# EAGLE design asam_mit_RFM (EAGLE 6.6.0)
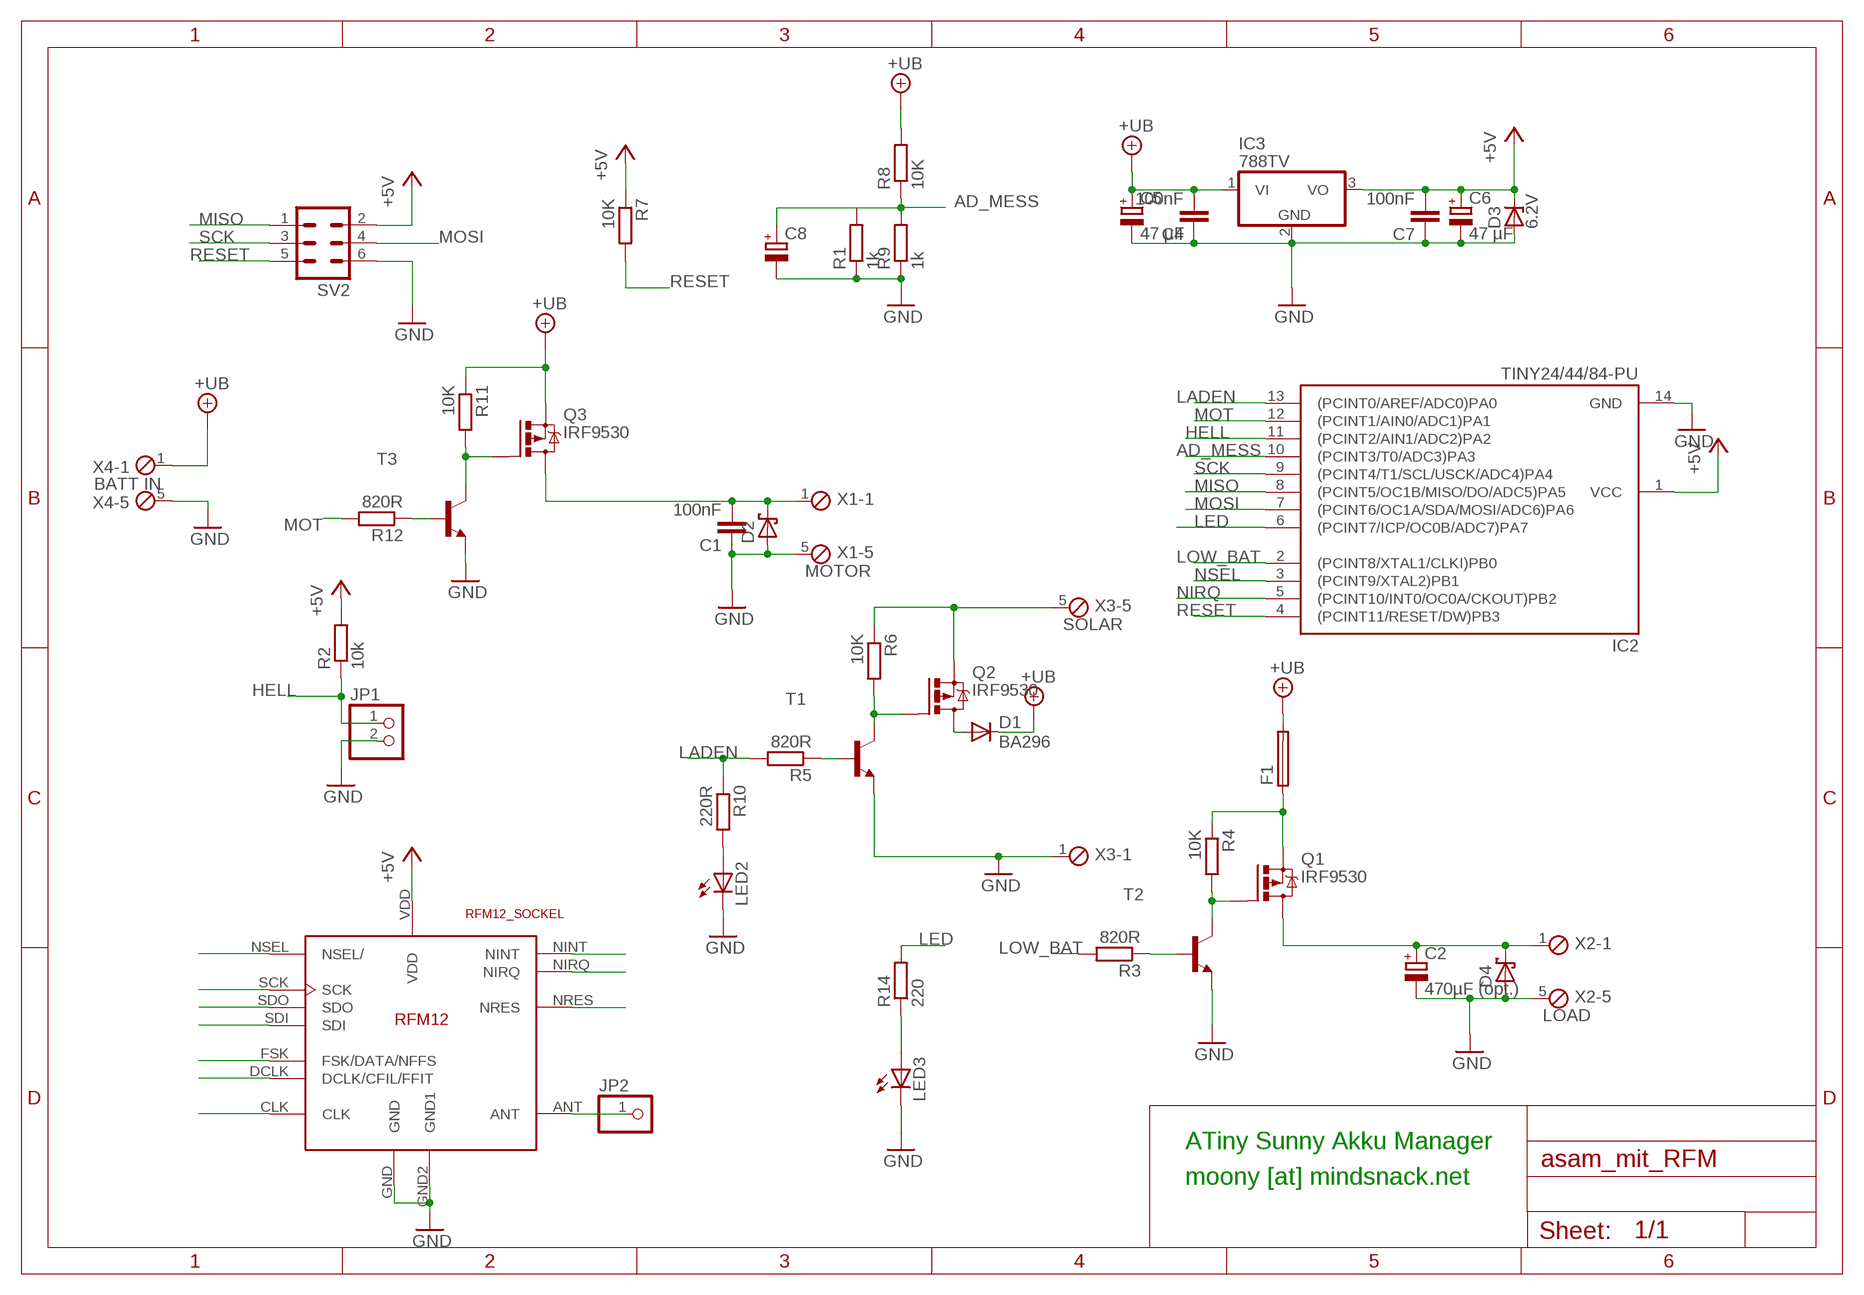
[diagram p0: schematic, sheet 1]

## Parts
C1  100nF  C-EU075-032X103  [C075-032X103]
C2  470µF (opt.)  CPOL-EUE5-10.5  [E5-10,5]
C4  100nF  C-EU075-032X103  [C075-032X103]
C5  47 µF  CPOL-EUE5-10.5  [E5-10,5]
C6  47 µF  CPOL-EUE5-10.5  [E5-10,5]
C7  100nF  C-EU075-032X103  [C075-032X103]
C8  CPOL-EUE5-10.5  [E5-10,5]
D1  BA296  [P2-15]
D2  SCHOTTKY-DIODEDO35-7  [DO35-7]
D3  6.2V  ZENER-DIODEC1702-15  [C1702-15]
D4  SCHOTTKY-DIODEDO35-7  [DO35-7]
F1  SH22,5  [SH22,5]
IC2  TINY24/44/84-PU  [DIL14]
IC3  788TV  [TO220V]
JP1  PINHD-1X2  [1X02]
JP2  PINHD-1X1  [1X01]
LED2  LED3MM  [LED3MM]
LED3  LED3MM  [LED3MM]
Q1  IRF9530  [TO220BV]
Q2  IRF9530  [TO220BV]
Q3  IRF9530  [TO220BV]
R1  1k  R-EU_0207/10  [0207/10]
R2  10k  R-EU_0207/10  [0207/10]
R3  820R  R-EU_0207/10  [0207/10]
R4  10K  R-EU_0207/12  [0207/12]
R5  820R  R-EU_0207/10  [0207/10]
R6  10K  R-EU_0207/12  [0207/12]
R7  10K  R-EU_0207/12  [0207/12]
R8  10K  R-EU_0207/10  [0207/10]
R9  1k  R-EU_0207/10  [0207/10]
R10  220R  R-EU_0207/10  [0207/10]
R11  10K  R-EU_0207/12  [0207/12]
R12  820R  R-EU_0207/10  [0207/10]
R14  220  R-EU_0207/10  [0207/10]
SV2  MA03-2  [MA03-2]
T1  BC546-NPN-TO92-CBE  [TO92-CBE]
T2  BC546-NPN-TO92-CBE  [TO92-CBE]
T3  BC546-NPN-TO92-CBE  [TO92-CBE]
U$1  RFM12_SOCKEL  [RFM12_SOCKEL]
X1  MOTOR  MPT5  [5POL254]
X2  LOAD  MPT5  [5POL254]
X3  SOLAR  MPT5  [5POL254]
X4  BATT IN  MPT5  [5POL254]

## Nets
+5V: C6.+ C7.2 D3.C IC2.1(VCC) IC3.3(VO) R2.2 R7.1 SV2.2 U$1.VDD
+UB: C4.2 C5.+ D1.C F1.2 IC3.1(VI) Q3.S R8.2 R11.1 X4.1
AD_MESS: C8.+ IC2.10((PCINT3/T0/ADC3)PA3) R1.2 R8.1 R9.2
GND: C1.1 C2.- C4.1 C5.- C6.- C7.1 C8.- D2.A D3.A D4.A IC2.14(GND) IC3.2(GND) JP1.2 LED2.K(C) LED3.K(C) R1.1 R9.1 SV2.6 T1.E T2.E T3.E U$1.GND U$1.GND2(GND1) X1.5 X2.5 X3.1 X4.5
HELL: IC2.11((PCINT2/AIN1/ADC2)PA2) JP1.1 R2.1
LADEN: IC2.13((PCINT0/AREF/ADC0)PA0) R5.2 R10.1
LED: IC2.6((PCINT7/ICP/OC0B/ADC7)PA7) R14.2
LOW_BAT: IC2.2((PCINT8/XTAL1/CLKI)PB0) R3.2
MISO: IC2.8((PCINT5/OC1B/MISO/DO/ADC5)PA5) SV2.1 U$1.SDI
MOSI: IC2.7((PCINT6/OC1A/SDA/MOSI/ADC6)PA6) SV2.4 U$1.SDO
MOT: IC2.12((PCINT1/AIN0/ADC1)PA1) R12.2
N$1: C1.2 D2.C Q3.D X1.1
N$2: R3.1 T2.B
N$3: Q1.G R4.2 T2.C
N$4: Q2.S R6.1 X3.5
N$5: Q2.G R6.2 T1.C
N$6: Q3.G R11.2 T3.C
N$7: R5.1 T1.B
N$8: LED2.A R10.2
N$9: D1.A Q2.D
N$10: R12.1 T3.B
N$11: F1.1 Q1.S R4.1
N$13: LED3.A R14.1
N$16: U$1.FSK(FSK/DATA/NFFS)
N$17: U$1.DCLK(DCLK/CFIL/FFIT)
N$18: C2.+ D4.C Q1.D X2.1
N$19: U$1.CLK
N$22: JP2.1 U$1.ANT
N$23: U$1.NRES
N$25: U$1.NINT
NIRQ: IC2.5((PCINT10/INT0/OC0A/CKOUT)PB2) U$1.NIRQ
NSEL: IC2.3((PCINT9/XTAL2)PB1) U$1.NSEL(NSEL/)
RESET: IC2.4((PCINT11/RESET/DW)PB3) R7.2 SV2.5
SCK: IC2.9((PCINT4/T1/SCL/USCK/ADC4)PA4) SV2.3 U$1.SCK
Unconnected: X1.2 X1.3 X1.4 X2.2 X2.3 X2.4 X3.2 X3.3 X3.4 X4.2 X4.3 X4.4

## Notes on the sheet
- ATiny Sunny Akku Manager
- moony [at] mindsnack.net

## Library data of the parts
C1 C4 C7 = rcl:C-EU: CAPACITOR, European symbol
C2 C5 C6 C8 = rcl:CPOL-EU: POLARIZED CAPACITOR, European symbol
D1 = diode:BA296: DIODE
D2 D4 = diode:SCHOTTKY-DIODE: Schottky Diode
D3 = diode:ZENER-DIODE: Z-Diode
F1 = fuse:SH22,5: FUSE HOLDER grid 22,5 mm, OGN0031 8201, Schurter (Buerklin); MF: SCHURTER; MPN: 0031.8201; OC_FARNELL: 1162740; OC_NEWARK: 96F8317
IC2 = avr-5:TINY24/44/84
IC3 = linear:78*: Positive VOLTAGE REGULATOR Source: http://cache.national.com/ds/LM/LM78L05.pdf http://www.fairchildsemi.com/ds/LM/LM7805.pdf
JP1 = pinhead:PINHD-1X2: PIN HEADER
JP2 = pinhead:PINHD-1X1: PIN HEADER
LED2 LED3 = led:LED: LED OSRAM: - CHIPLED LG R971, LG N971, LY N971, LG Q971, LY Q971, LO R971, LY R971 LH N974, LH R974 LS Q976, LO Q976, LY Q976 LO Q996 - Hyper CHIPLED LW Q18S LB Q993, LB Q99A, LB R99A - SideLED LS A670, LO A670, LY A670, LG A670, LP A670 LB A673, LV A673, LT A673, LW A673 LH A674 LY A675 LS A676, LA A676, LO A676, LY A676, LW A676 LS A679, LY A679, LG A679 - Hyper Micro SIDELED® LS Y876, LA Y876, LO Y876, LY Y876 LT Y87S - SmartLED LW L88C, LW L88S LB L89C, LB L89S, LG L890 LS L89K, LO L89K, LY L89K LS L896, LA L896, LO L896, LY L896 - TOPLED LS T670, LO T670, LY T670, LG T670, LP T670 LSG T670, LSP T670, LSY T670, LOP T670, LYG T670 LG T671, LOG T671, LSG T671 LB T673, LV T673, LT T673, LW T673 LH T674 LS T676, LA T676, LO T676, LY T676, LB T676, LH T676, LSB T676, LW T676 LB T67C, LV T67C, LT T67C, LS T67K, LO T67K, LY T67K, LW E67C LS E67B, LA E67B, LO E67B, LY E67B, LB E67C, LV E67C, LT E67C LW T67C LS T679, LY T679, LG T679 LS T770, LO T770, LY T770, LG T770, LP T770 LB T773, LV T773, LT T773, LW T773 LH T774 LS E675, LA E675, LY E675, LS T675 LS T776, LA T776, LO T776, LY T776, LB T776 LHGB T686 LT T68C, LB T68C - Hyper Mini TOPLED® LB M676 - Mini TOPLED Santana® LG M470 LS M47K, LO M47K, LY M47K Source: http://www.osram.convergy.de LUXEON: - LUMILED® LXK2-PW12-R00, LXK2-PW12-S00, LXK2-PW14-U00, LXK2-PW14-V00 LXK2-PM12-R00, LXK2-PM12-S00, LXK2-PM14-U00 LXK2-PE12-Q00, LXK2-PE12-R00, LXK2-PE12-S00, LXK2-PE14-T00, LXK2-PE14-U00 LXK2-PB12-K00, LXK2-PB12-L00, LXK2-PB12-M00, LXK2-PB14-N00, LXK2-PB14-P00, LXK2-PB14-Q00 LXK2-PR12-L00, LXK2-PR12-M00, LXK2-PR14-Q00, LXK2-PR14-R00 LXK2-PD12-Q00, LXK2-PD12-R00, LXK2-PD12-S00 LXK2-PH12-R00, LXK2-PH12-S00 LXK2-PL12-P00, LXK2-PL12-Q00, LXK2-PL12-R00 Source: www.luxeon.com KINGBRIGHT: KA-3528ASYC Source: www.kingbright.com
Q1-Q3 = transistor-power:IRF9530: P-CHANNEL HEXFET POWER-MOS-FET Source: http://www.irf.com/product-info/datasheets/data/irf9530.pdf
R1-R12 R14 = rcl:R-EU_: RESISTOR, European symbol
SV2 = con-lstb:MA03-2: PIN HEADER; OC_FARNELL: unknown; OC_NEWARK: unknown
T1-T3 = transistor:*-NPN-: NPN Transistror BF959 corrected 2008.03.06
U$1 = RFM12:RFM12_SOCKEL
X1-X4 = con-phoenix-254:MPT5: PHOENIX CONNECTOR; OC_FARNELL: unknown; OC_NEWARK: unknown

## Board
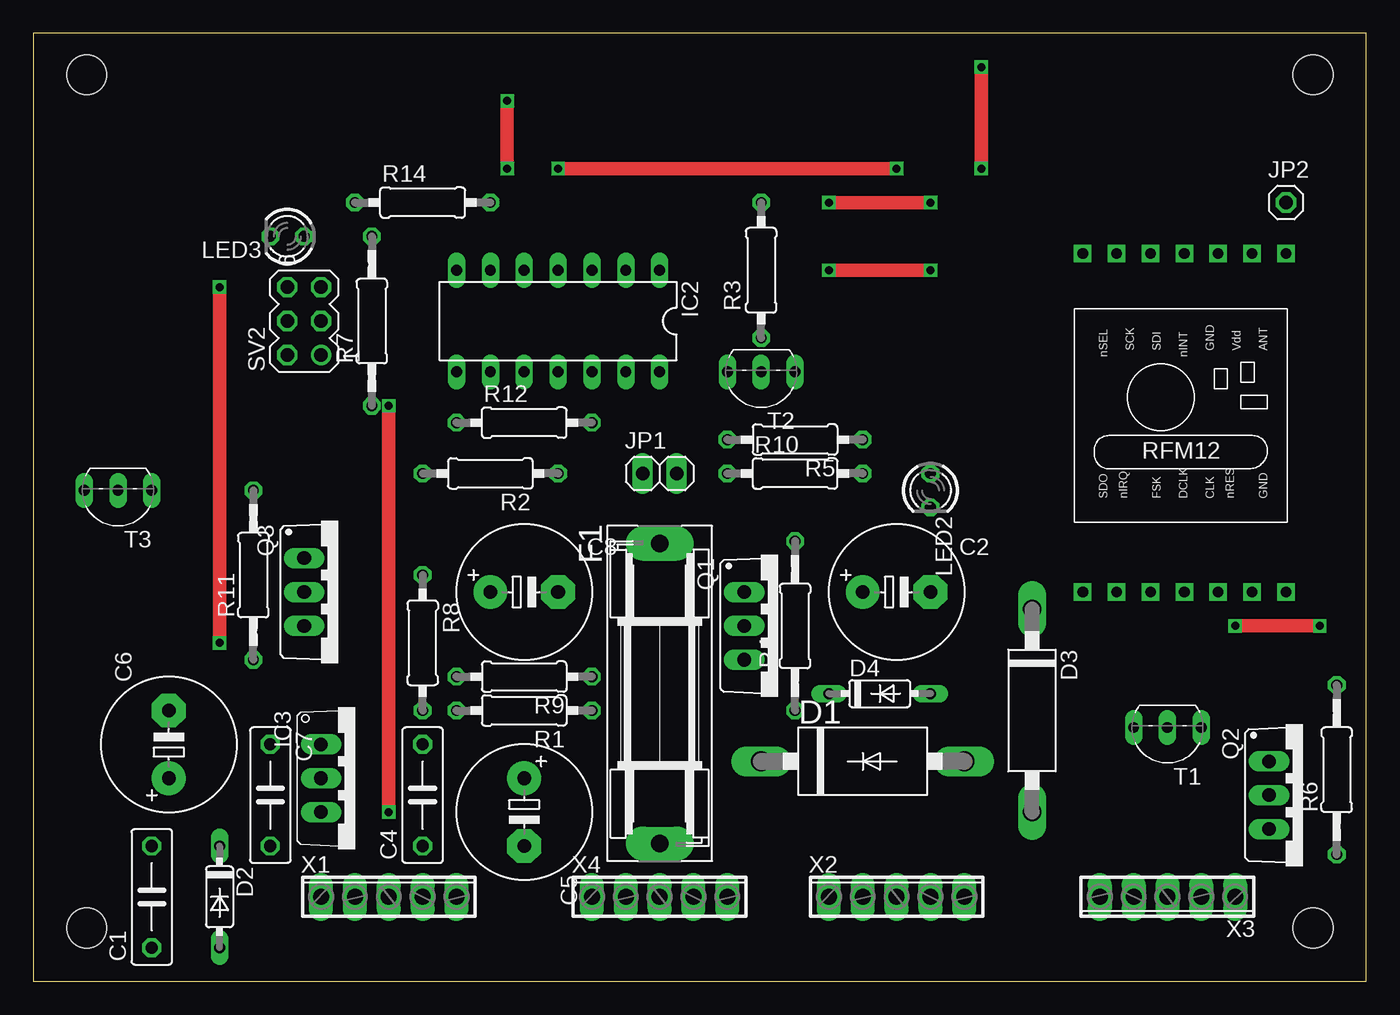
[diagram p1: board, top side]
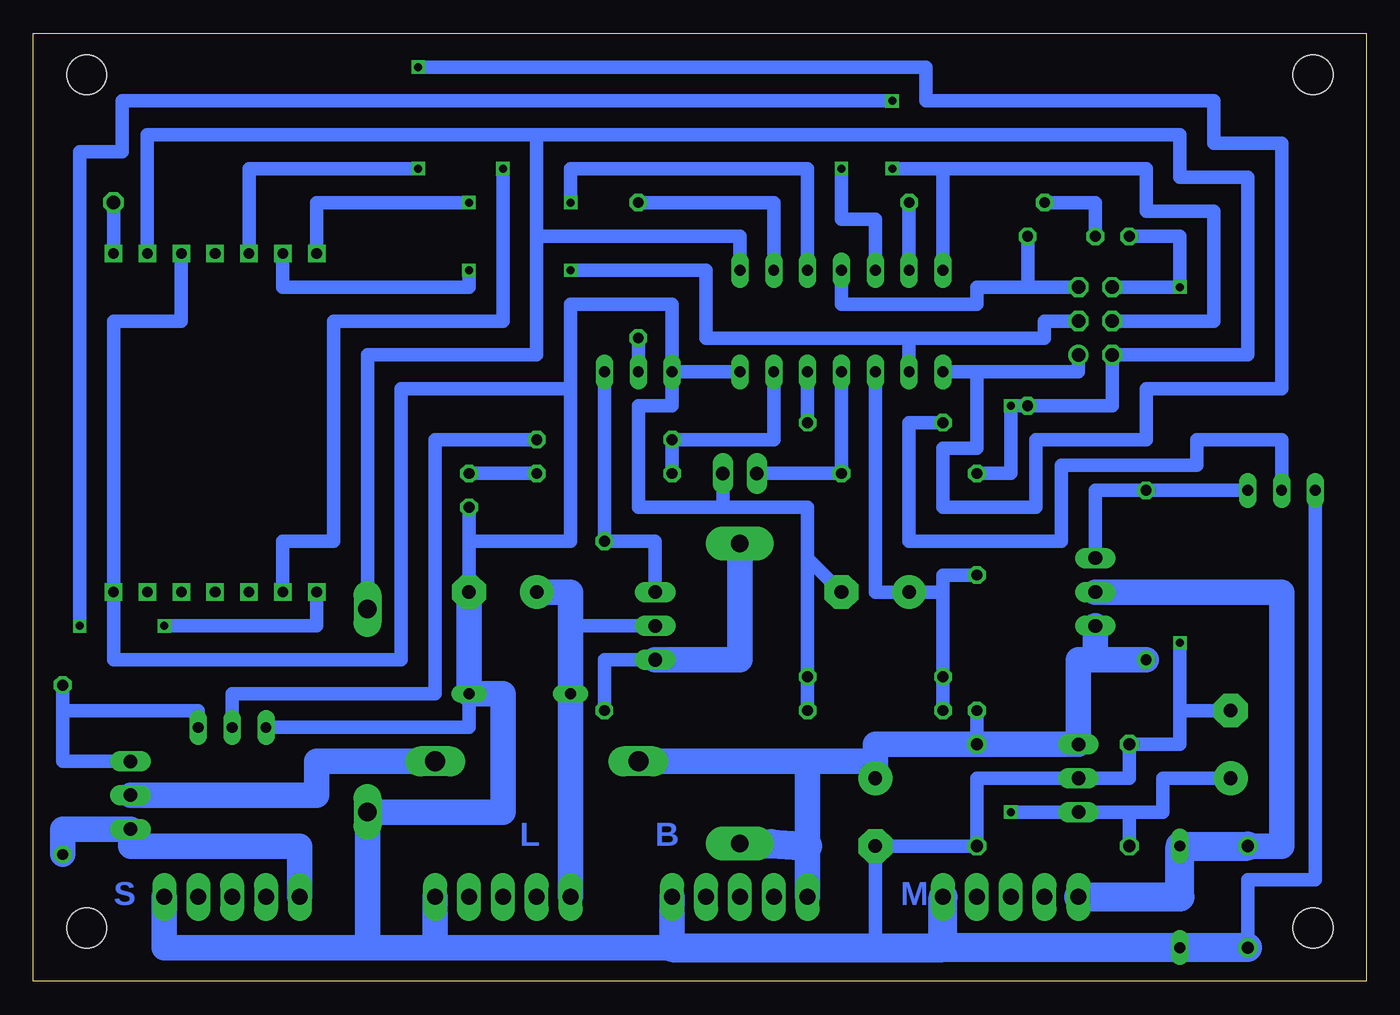
[diagram p2: board, bottom side, seen from below]

Size 100 x 71.11 mm. Coordinates in mm from the lower left corner, seen from the top.
Outline: 0,0 100,0 100,71.11 0,71.11 0,0
Copper layers (1*16): Top 0.035mm / dielectric 1.5mm / Bottom 0.035mm
Design rules "default": minimum track width 10mil, minimum drill 24mil, track to track 8mil, track to pad 8mil, pad to pad 8mil, via to via 8mil, smd to smd 8mil, copper to edge 40mil, drill to drill 8mil, minimum pad ring 10mil, minimum via ring 8mil, stop-mask expansion 4mil, vias tented up to drill 0mil, thermal gap 10mil
Holes 3 mm at 4,4 4,68 96,68 96,4

### Footprints (pad centres in the part's own frame; a part is rotated, then mirrored left to right if it is on the bottom)
C075-032X103 = drill 0.914 octagon: 1 -3.81,0; 2 3.81,0
E5-10,5 = drill 1.016 pad 2.54: + -2.54,0 | drill 1.016 pad 2.54 octagon: - 2.54,0
P2-15 = drill 1.499 long: A 7.62,0; C -7.62,0
DO35-7 = drill 0.813 long: A 3.81,0; C -3.81,0
C1702-15 = drill 1.397 long: A 7.62,0; C -7.62,0
SH22,5 = drill 1.321 pad 2.54 long: 1 -11.252,0; 2 11.252,0
DIL14 = drill 0.813 long: 1 -7.62,-3.81; 2 -5.08,-3.81; 3 -2.54,-3.81; 4 0,-3.81; 5 2.54,-3.81; 6 5.08,-3.81; 7 7.62,-3.81; 8 7.62,3.81; 9 5.08,3.81; 10 2.54,3.81; 11 0,3.81; 12 -2.54,3.81; 13 -5.08,3.81; 14 -7.62,3.81
TO220V = drill 1.016 long: 1 -2.54,-2.54; 2 0,-2.54; 3 2.54,-2.54
1X02 = drill 1.016 long: 1 -1.27,0; 2 1.27,0
1X01 = drill 1.016 octagon: 1 0,0
LED3MM = drill 0.813 octagon: A -1.27,0; K 1.27,0
TO220BV = drill 1.016 long: D 0,-2.54; G -2.54,-2.54; S 2.54,-2.54
0207/10 = drill 0.813 octagon: 1 -5.08,0; 2 5.08,0
0207/12 = drill 0.813 octagon: 1 -6.35,0; 2 6.35,0
MA03-2 = drill 1.016: 1 -2.54,-1.27 | drill 1.016 octagon: 2 -2.54,1.27; 3 0,-1.27; 4 0,1.27; 5 2.54,-1.27; 6 2.54,1.27
TO92-CBE = drill 0.813 long: B 0,0; C -2.54,0; E 2.54,0
RFM12_SOCKEL = drill 0.8 square: ANT 15.24,25.4; CLK 10.16,0; DCLK 7.62,0; FSK 5.08,0; GND 15.24,0; GND2 10.16,25.4; NINT 7.62,25.4; NIRQ 2.54,0; NRES 12.7,0; NSEL 0,25.4; SCK 2.54,25.4; SDI 5.08,25.4; SDO 0,0; VDD 12.7,25.4
5POL254 = drill 1.2 long: 1 -5.08,0; 2 -2.54,0; 3 0,0; 4 2.54,0; 5 5.08,0

### Placement (x,y rotation side)
C1  8.89,6.35 90 top
C2  64.77,29.21 0 top
C4  29.21,13.97 90 top
C5  36.83,12.7 270 top
C6  10.16,17.78 90 top
C7  17.78,13.97 270 top
C8  36.83,29.21 0 top
D1  62.23,16.51 0 top
D2  13.97,6.35 270 top
D3  74.93,20.32 270 top
D4  63.5,21.59 0 top
F1  46.99,21.59 270 top
IC2  39.37,49.53 180 top
IC3  24.13,15.24 270 top
JP1  46.99,38.1 0 top
JP2  93.98,58.42 0 top
LED2  67.31,36.83 270 top
LED3  19.05,55.88 180 top
Q1  55.88,26.67 270 top
Q2  95.25,13.97 270 top
Q3  22.86,29.21 270 top
R1  36.83,20.32 180 top
R2  34.29,38.1 180 top
R3  54.61,53.34 90 top
R4  57.15,26.67 90 top
R5  57.15,40.64 180 top
R6  97.79,15.88 90 top
R7  25.4,49.53 90 top
R8  29.21,25.4 270 top
R9  36.83,22.86 180 top
R10  57.15,38.1 0 top
R11  16.51,30.48 90 top
R12  36.83,41.91 0 top
R14  29.21,58.42 0 top
SV2  20.32,49.53 90 top
T1  85.09,19.05 180 top
T2  54.61,45.72 180 top
T3  6.35,36.83 180 top
U$1  78.74,29.21 0 top
X1  26.67,6.35 0 top
X2  64.77,6.35 0 top
X3  85.09,6.35 180 top
X4  46.99,6.35 0 top

### Tracks (layer width: path | path; a pad name or v marks a point on that pad's centre or on a via)
+5V  (via drill 0.6)
  Top 1.016: v26.67,12.7 v26.67,43.18
  Bottom 1.016: D3.C 74.93,46.99 62.23,46.99 62.23,55.88 | C6.+ 15.24,15.24 15.24,12.7 17.78,12.7 | IC2.1 46.99,55.88 62.23,55.88 | 62.23,55.88 62.23,63.5 | 62.23,63.5 13.97,63.5 13.97,60.33 8.89,60.33 8.89,46.99 SV2.2 19.05,43.18 R7.1 v26.67,43.18 26.67,38.1 R2.2 | v26.67,12.7 IC3.3 17.78,12.7 | U$1.VDD 91.44,63.5 62.23,63.5 | C7.2 17.78,12.7
+UB
  Bottom 1.016: R8.2 C4.2
  Bottom 1.93: D1.C 41.91,16.51 | 41.91,16.51 41.91,10.16 X4.1 | Q3.S 20.32,24.13 | 20.32,24.13 21.59,24.13 IC3.1 C4.2 36.83,17.78 36.83,16.51 | R11.1 20.32,24.13 | 41.91,16.51 36.83,16.51 | 36.83,16.51 C5.+
  Bottom 2.184: F1.2 44.63,10.34 41.91,10.16
AD_MESS
  Bottom 1.016: IC2.10 36.83,29.21 C8.+ 31.75,29.21 | R1.2 R9.2 31.75,29.21 | 31.75,29.21 31.75,30.48 R8.1
GND  (via drill 0.6)
  Top 1.016: v13.97,52.07 v13.97,25.4
  Bottom 1.016: 36.83,2.54 C5.- C4.1 29.21,15.24 IC3.2 17.78,15.24 C7.1 13.97,17.78 13.97,20.32 | SV2.6 v13.97,52.07 13.97,55.88 LED3.K | v13.97,25.4 13.97,20.32 | R1.1 R9.1 41.91,31.75 | 41.91,31.75 41.91,35.56 48.26,35.56 | C2.- 67.31,33.02 | 67.31,33.02 59.69,33.02 59.69,44.45 | T3.E 3.81,7.62 8.89,7.62 C1.1 | T1.E 67.31,19.05 D4.A | T2.E IC2.14 | T2.E 52.07,43.18 54.61,43.18 54.61,35.56 48.26,35.56 | LED2.K 67.31,33.02 | 48.26,35.56 JP1.2 | C8.- 41.91,31.75 | U$1.GND2 88.9,49.53 93.98,49.53 U$1.GND 93.98,24.13 72.39,24.13 72.39,44.45 59.69,44.45 | 59.69,44.45 59.69,50.8 52.07,50.8 T2.E | C6.- 13.97,20.32
  Bottom 1.93: 74.93,2.54 69.85,2.54 | 69.85,2.54 52.07,2.54 X4.5 | X2.5 69.85,2.54 | 74.93,2.54 D3.A 64.77,12.7 64.77,21.59 D4.A C2.- | 74.93,2.54 90.17,2.54 X3.1
  Bottom 2.184: 52.07,2.54 36.83,2.54 31.75,2.54 | 31.75,2.54 X1.5 | C1.1 D2.A 31.75,2.54
HELL
  Bottom 1.016: IC2.11 R2.1 JP1.1
LADEN
  Bottom 1.016: R10.1 R5.2 44.45,40.64 IC2.13
LED
  Bottom 1.016: IC2.6 R14.2
LOW_BAT
  Bottom 1.016: R3.2 44.45,58.42 IC2.2
MISO  (via drill 0.6)
  Top 1.016: v71.12,68.58 v71.12,60.96
  Bottom 1.016: IC2.8 29.21,45.72 | 29.21,45.72 21.59,45.72 SV2.1 | U$1.SDI 83.82,60.96 v71.12,60.96 | v71.12,68.58 33.02,68.58 33.02,66.04 11.43,66.04 11.43,62.87 6.35,62.87 6.35,44.45 16.51,44.45 16.51,40.64 24.77,40.64 24.77,35.56 31.75,35.56 31.75,40.01 29.21,40.01 29.21,45.72
MOSI  (via drill 0.6)
  Top 1.016: v35.56,60.96 v35.56,66.04 | v96.52,26.67 v90.17,26.67
  Bottom 1.016: IC2.7 31.75,60.96 | SV2.4 11.43,49.53 11.43,57.78 16.51,57.78 16.51,60.96 31.75,60.96 | 31.75,60.96 v35.56,60.96 | v35.56,66.04 93.34,66.04 93.34,62.23 96.52,62.23 v96.52,26.67 | v90.17,26.67 78.74,26.67 U$1.SDO
MOT
  Bottom 1.016: IC2.12 R12.2
N$1
  Bottom 1.93: Q3.D 6.35,29.21 6.35,10.16 C1.2
  Bottom 2.184: X1.1 13.97,6.35 D2.C C1.2
N$2
  Bottom 1.016: R3.1 T2.B
N$3
  Bottom 1.016: Q1.G 53.34,33.02 R4.2 T2.C
N$4
  Bottom 1.93: X3.5 80.01,10.16 92.71,10.16 Q2.S 97.79,11.43 R6.1
N$5
  Bottom 1.016: Q2.G 97.79,16.51 R6.2 97.79,20.32 87.63,20.32 T1.C
N$6
  Bottom 1.016: T3.C R11.2 20.32,36.83 Q3.G
N$7
  Bottom 1.016: T1.B 85.09,21.59 69.85,21.59 69.85,40.64 R5.1
N$8
  Bottom 1.016: R10.2 LED2.A
N$9
  Bottom 1.93: Q2.D 78.74,13.97 78.74,16.51 D1.A
N$10
  Bottom 1.016: R12.1 34.29,41.91 34.29,33.02 22.86,33.02 22.86,38.73 12.7,38.73 12.7,40.64 6.35,40.64 T3.B
N$11
  Bottom 1.016: R4.1 57.15,24.13 Q1.S
  Bottom 1.93: Q1.S 46.99,24.13 F1.1
N$13
  Bottom 1.016: R14.1 20.32,58.42 LED3.A
N$18
  Bottom 1.016: Q1.D 59.69,26.67
  Bottom 1.93: X2.1 D4.C 59.69,26.67 59.69,29.21 C2.+
N$22
  Bottom 1.016: U$1.ANT JP2.1
NIRQ  (via drill 0.6)
  Top 1.016: v39.37,60.96 v64.77,60.96
  Bottom 1.016: IC2.5 36.83,57.15 39.37,57.15 v39.37,60.96 | v64.77,60.96 64.77,49.53 77.47,49.53 77.47,33.02 81.28,33.02 U$1.NIRQ
NSEL  (via drill 0.6)
  Top 1.016: v59.69,58.42 v67.31,58.42
  Bottom 1.016: U$1.NSEL 78.74,58.42 v67.31,58.42 | IC2.3 41.91,60.96 59.69,60.96 v59.69,58.42
RESET
  Bottom 1.016: 25.4,52.07 29.21,52.07 29.21,50.8 39.37,50.8 IC2.4 | SV2.5 25.4,52.07 | R7.2 25.4,52.07
SCK  (via drill 0.6)
  Top 1.016: v67.31,53.34 v59.69,53.34
  Bottom 1.016: SV2.3 24.13,49.53 24.13,48.26 34.29,48.26 | 34.29,48.26 IC2.9 | U$1.SCK 81.28,52.07 67.31,52.07 v67.31,53.34 | v59.69,53.34 49.53,53.34 49.53,48.26 34.29,48.26

### Text on the board
Bottom: B | L | M | S